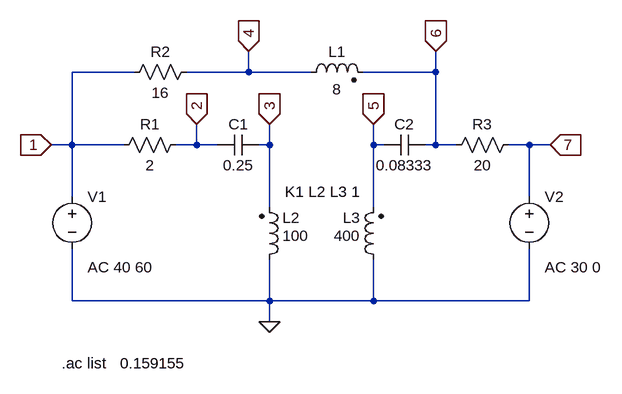
[diagram p0: schematic coupled inductors circuit 2.asc]
coupled inductors circuit 2.asc, the LTspice schematic file:
Version 4
SHEET 1 880 680
WIRE 16 48 -80 48
WIRE 192 48 192 16
WIRE 192 48 96 48
WIRE 288 48 192 48
WIRE 480 48 480 16
WIRE 480 48 368 48
WIRE -80 160 -80 48
WIRE -80 160 -112 160
WIRE 0 160 -80 160
WIRE 112 160 112 128
WIRE 112 160 80 160
WIRE 144 160 112 160
WIRE 224 160 224 128
WIRE 224 160 208 160
WIRE 384 160 384 128
WIRE 400 160 384 160
WIRE 480 160 480 48
WIRE 480 160 464 160
WIRE 512 160 480 160
WIRE 624 160 592 160
WIRE 656 160 624 160
WIRE -80 240 -80 160
WIRE 624 240 624 160
WIRE 224 256 224 160
WIRE 384 256 384 160
WIRE -80 400 -80 320
WIRE 224 400 224 336
WIRE 224 400 -80 400
WIRE 384 400 384 336
WIRE 384 400 224 400
WIRE 624 400 624 320
WIRE 624 400 384 400
WIRE 224 432 224 400
FLAG 224 432 0
FLAG -112 160 1
IOPIN -112 160 In
FLAG 192 16 4
IOPIN 192 16 In
FLAG 112 128 2
IOPIN 112 128 In
FLAG 224 128 3
IOPIN 224 128 In
FLAG 384 128 5
IOPIN 384 128 In
FLAG 480 16 6
IOPIN 480 16 In
FLAG 656 160 7
IOPIN 656 160 In
SYMBOL res -16 176 R270
WINDOW 0 32 56 VTop 2
WINDOW 3 0 56 VBottom 2
SYMATTR InstName R1
SYMATTR Value 2
SYMBOL res 0 64 R270
WINDOW 0 32 56 VTop 2
WINDOW 3 0 56 VBottom 2
SYMATTR InstName R2
SYMATTR Value 16
SYMBOL res 496 176 R270
WINDOW 0 32 56 VTop 2
WINDOW 3 0 56 VBottom 2
SYMATTR InstName R3
SYMATTR Value 20
SYMBOL cap 144 176 R270
WINDOW 0 32 32 VTop 2
WINDOW 3 0 32 VBottom 2
SYMATTR InstName C1
SYMATTR Value 0.25
SYMBOL cap 400 176 R270
WINDOW 0 32 32 VTop 2
WINDOW 3 0 32 VBottom 2
SYMATTR InstName C2
SYMATTR Value 0.08333
SYMBOL ind2 272 64 R270
WINDOW 0 32 56 VTop 2
WINDOW 3 5 56 VBottom 2
SYMATTR InstName L1
SYMATTR Value 8
SYMATTR Type ind
SYMBOL ind2 208 352 M180
WINDOW 0 36 80 Left 2
WINDOW 3 36 52 Left 2
SYMATTR InstName L2
SYMATTR Value 100
SYMATTR Type ind
SYMBOL ind2 400 352 R180
WINDOW 0 36 80 Left 2
WINDOW 3 36 52 Left 2
SYMATTR InstName L3
SYMATTR Value 400
SYMATTR Type ind
SYMBOL voltage -80 224 R0
WINDOW 123 24 124 Left 2
WINDOW 39 0 0 Left 2
SYMATTR Value2 AC 40 60
SYMATTR InstName V1
SYMATTR Value ""
SYMBOL voltage 624 224 R0
WINDOW 123 24 124 Left 2
WINDOW 39 0 0 Left 2
SYMATTR Value2 AC 30 0
SYMATTR InstName V2
SYMATTR Value ""
TEXT 248 232 Left 2 !K1 L2 L3 1
TEXT -96 496 Left 2 !.ac list   0.159155

The netlist it stands for:
* coupled inductors circuit 2.asc
R1 1 2 2
R2 1 4 16
R3 6 7 20
C1 2 3 0.25
C2 5 6 0.08333
L1 4 6 8
L2 0 3 100
L3 0 5 400
V1 1 0 AC 40 60
V2 7 0 AC 30 0
K1 L2 L3 1
.ac list   0.159155
.backanno
.end